# Altium schematic sheet Logturtle_TX_Toplevel.SchDoc
size A4; SheetNumber: 1; SheetTotal: 7
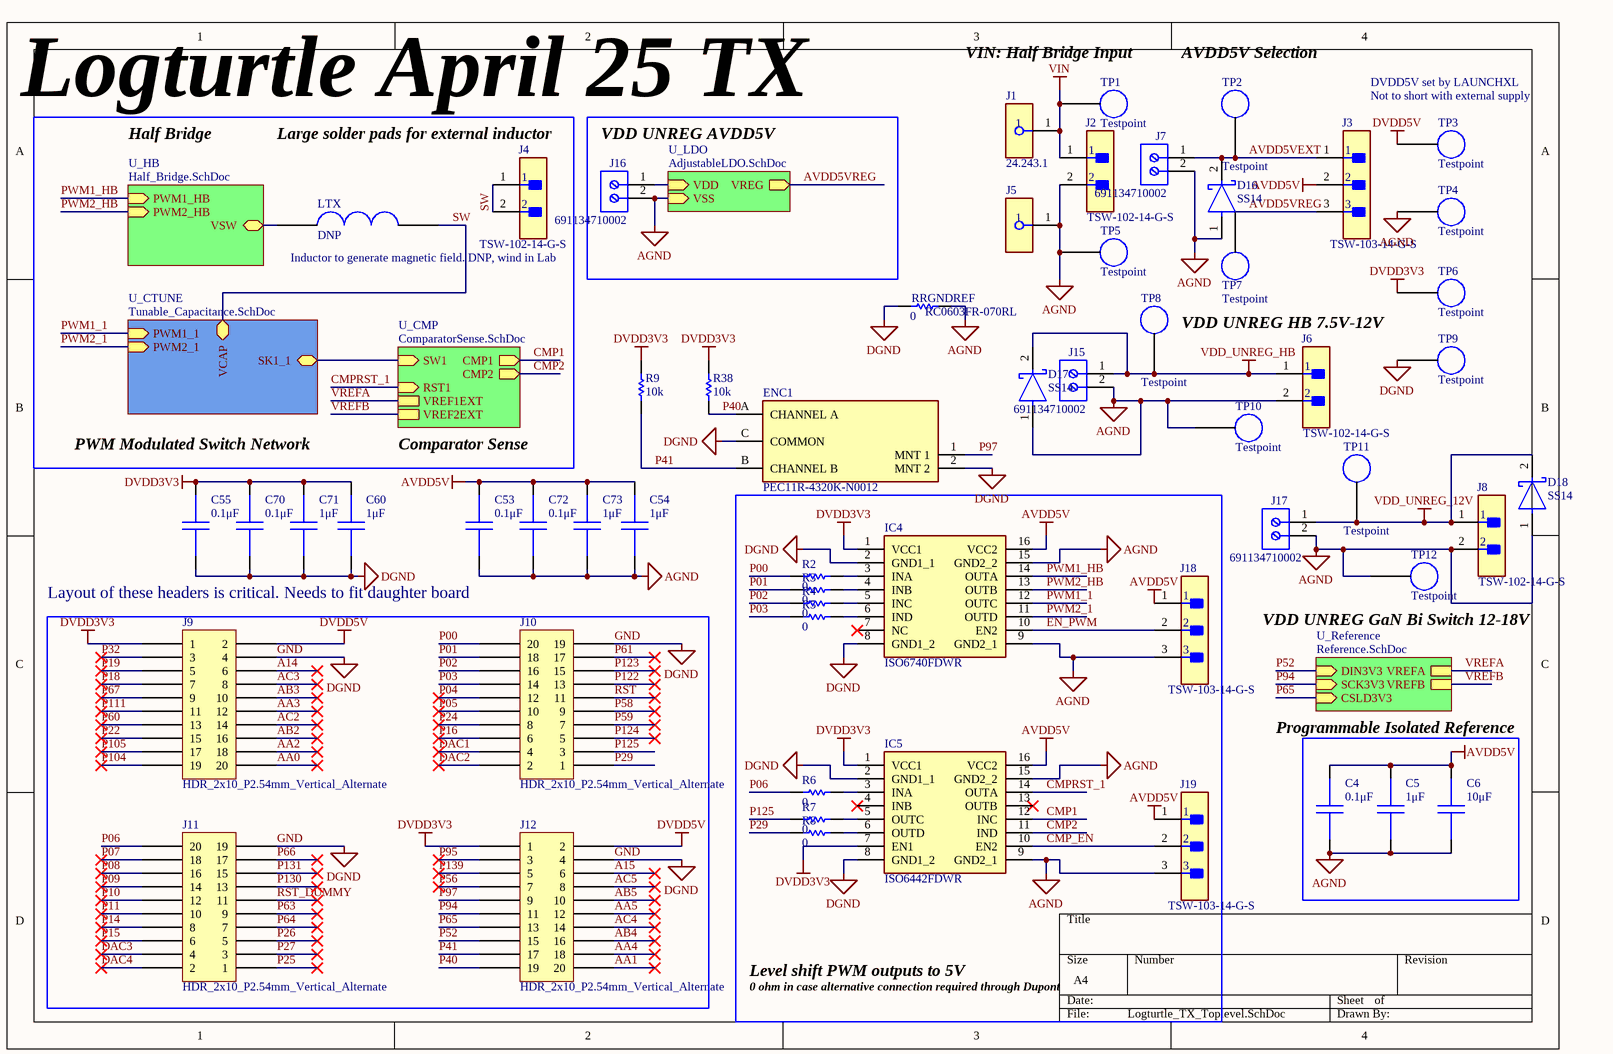
[diagram p0: Logturtle_TX_Toplevel.SchDoc]

## Parts
C4  0.1μF  [CAPC1608X90N]
C5  1μF  [CAPC1608X09N]
C6  10μF  [CAPC2012X14N]
C53  0.1μF  [CAPC1608X90N]
C54  1μF  [CAPC1608X09N]
C55  0.1μF  [CAPC1608X90N]
C60  1μF  [CAPC1608X09N]
C70  0.1μF  [CAPC1608X90N]
C71  1μF  [CAPC1608X09N]
C72  0.1μF  [CAPC1608X90N]
C73  1μF  [CAPC1608X09N]
D16  SS14  [FP-403AE-MFG]
D17  SS14  [FP-403AE-MFG]
D18  SS14  [FP-403AE-MFG]
ENC1  PEC11R-4320K-N0012  [FP-PEC11R-4320K-N0012-MFG]
IC4  ISO6740FDWR  [SOIC127P1030X255-16N]
IC5  ISO6442FDWR  [SOIC127P1030X255-16N]
J1  24.243.1  [FP-24_243_1-MFG]
J2  TSW-102-14-G-S  [FP-TSW-102-14-G-S-MFG]
J3  TSW-103-14-G-S  [FP-TSW-103-14-G-S-MFG]
J4  TSW-102-14-G-S  [FP-TSW-102-14-G-S-MFG]
J5  (no value)  [FP-24_243_2-MFG]
J6  TSW-102-14-G-S  [FP-TSW-102-14-G-S-MFG]
J7  691134710002  [691134710002]
J8  TSW-102-14-G-S  [FP-TSW-102-14-G-S-MFG]
J9  HDR_2x10_P2.54mm_Vertical_Alternate  [HDR_2x10_P2.54mm_Vertical - Alternate]
J10  HDR_2x10_P2.54mm_Vertical_Alternate  [HDR_2x10_P2.54mm_Vertical - Alternate]
J11  HDR_2x10_P2.54mm_Vertical_Alternate  [HDR_2x10_P2.54mm_Vertical - Alternate]
J12  HDR_2x10_P2.54mm_Vertical_Alternate  [HDR_2x10_P2.54mm_Vertical - Alternate]
J15  691134710002  [691134710002]
J16  691134710002  [691134710002]
J17  691134710002  [691134710002]
J18  TSW-103-14-G-S  [FP-TSW-103-14-G-S-MFG]
J19  TSW-103-14-G-S  [FP-TSW-103-14-G-S-MFG]
LTX  DNP  [InductorTerminals]
R2  value 0  [RESC1608X55N]  (hidden comment: RC0603FR-070RL)
R3  value 0  [RESC1608X55N]  (hidden comment: RC0603FR-070RL)
R4  value 0  [RESC1608X55N]  (hidden comment: RC0603FR-070RL)
R5  value 0  [RESC1608X55N]  (hidden comment: RC0603FR-070RL)
R6  value 0  [RESC1608X55N]  (hidden comment: RC0603FR-070RL)
R7  value 0  [RESC1608X55N]  (hidden comment: RC0603FR-070RL)
R8  value 0  [RESC1608X55N]  (hidden comment: RC0603FR-070RL)
R9  value 10k  [RESC1608X55N]  (hidden comment: RC0603FR0710KL)
R38  value 10k  [RESC1608X55N]  (hidden comment: RC0603FR0710KL)
RRGNDREF  RC0603FR-070RL  value 0  [RESC1608X55N]
TP1  Testpoint  [TP_5006]
TP2  Testpoint  [TP_5006]
TP3  Testpoint  [TP_5006]
TP4  Testpoint  [TP_5006]
TP5  Testpoint  [TP_5006]
TP6  Testpoint  [TP_5006]
TP7  Testpoint  [TP_5006]
TP8  Testpoint  [TP_5006]
TP9  Testpoint  [TP_5006]
TP10  Testpoint  [TP_5006]
TP11  Testpoint  [TP_5006]
TP12  Testpoint  [TP_5006]

## Blocks framed on the sheet
VDD UNREG AVDD5V: J16
Level shift PWM outputs to 5V: IC4 IC5 J18 J19 R2-R8

## Sub-sheets
U_CMP = ComparatorSense.SchDoc: SW1 (in), CMP1 (out), CMP2 (out), RST1 (in), VREF1EXT, VREF2EXT
U_CTUNE = Tunable_Capacitance.SchDoc: PWM1_1 (in), PWM2_1 (in), VCAP (bidir), SK1_1 (bidir)
U_HB = Half_Bridge.SchDoc: VSW (bidir), PWM1_HB (in), PWM2_HB (in)
U_LDO = AdjustableLDO.SchDoc: VDD (in), VREG (out), VSS (in)
U_Reference = Reference.SchDoc: VREFA, VREFB, DIN3V3 (in), SCK3V3 (in), CSLD3V3 (in)

## Nets
AGND: C4.1 C5.1 C6.1 C53.1 C54.1 C72.1 C73.1 D16.1(A) D17.1(A) D18.1(A) IC4.9(GND2_1) IC4.15(GND2_2) IC5.9(GND2_1) IC5.15(GND2_2) J2.2 J5.1 J6.2 J7.2 J8.2 J15.2 J16.2 J17.2 J18.3 J19.3 RRGNDREF.1 TP4.1 TP5.1 TP10.1 TP12.1 ; sheet U_LDO/VSS
AVDD5V: C4.2 C5.2 C6.2 C53.2 C54.2 C72.2 C73.2 IC4.16(VCC2) IC5.16(VCC2) J3.2 J18.1 J19.1
DVDD3V3: C55.2 C60.2 C70.2 C71.2 IC4.1(VCC1) IC5.1(VCC1) IC5.7(EN1) J9.1 J12.1 R9.2 R38.2 TP6.1
DVDD5V: J9.2 J12.2 TP3.1
GND: C55.1 C60.1 C70.1 C71.1 ENC1.2(MNT_2) ENC1.C(COMMON) IC4.2(GND1_1) IC4.8(GND1_2) IC5.2(GND1_1) IC5.8(GND1_2) J9.4 J10.19 J11.19 J12.4 RRGNDREF.2 TP9.1  [also labelled DGND]
VDD_UNREG_12V: D18.2(C) J8.1 J17.1 TP11.1
VDD_UNREG_HB: D17.2(C) J6.1 J15.1 TP8.1
VIN: J1.1 J2.1 TP1.1
A14: J9.6
A15: J12.6
AA0: J9.20
AA1: J12.20
AA2: J9.18
AA3: J9.12
AA4: J12.18
AA5: J12.12
AB2: J9.16
AB3: J9.10
AB4: J12.16
AB5: J12.10
AC2: J9.14
AC3: J9.8
AC4: J12.14
AC5: J12.8
AVDD5VEXT: D16.2(C) J3.1 J7.1 TP2.1
AVDD5VREG: J3.3 TP7.1 ; sheet U_LDO/VREG
CMP1: IC5.12(INC) ; sheet U_CMP/CMP1
CMP2: IC5.11(IND) ; sheet U_CMP/CMP2
CMP_EN: IC5.10(EN2) J19.2
CMPRST_1: IC5.14(OUTA) ; sheet U_CMP/RST1
DAC1: J10.4
DAC2: J10.2
DAC3: J11.4
DAC4: J11.2
EN_PWM: IC4.10(EN2) J18.2
P00: J10.20 R2.1
P01: J10.18 R3.1
P02: J10.16 R4.1
P03: J10.14 R5.1
P04: J10.12
P05: J10.10
P06: J11.20 R6.1
P07: J11.18
P08: J11.16
P09: J11.14
P10: J11.12
P11: J11.10
P14: J11.8
P15: J11.6
P16: J10.6
P18: J9.7
P19: J9.5
P22: J9.15
P24: J10.8
P25: J11.1
P26: J11.5
P27: J11.3
P29: J10.1 R8.1
P32: J9.3
P40: ENC1.A(CHANNEL_A) J12.19 R38.1
P41: ENC1.B(CHANNEL_B) J12.17 R9.1
P52: J12.15 ; sheet U_Reference/DIN3V3
P56: J12.7
P58: J10.9
P59: J10.7
P60: J9.13
P61: J10.17
P63: J11.9
P64: J11.7
P65: J12.13 ; sheet U_Reference/CSLD3V3
P66: J11.17
P67: J9.9
P94: J12.11 ; sheet U_Reference/SCK3V3
P95: J12.3
P97: ENC1.1(MNT_1) J12.9
P104: J9.19
P105: J9.17
P111: J9.11
P122: J10.13
P123: J10.15
P124: J10.5
P125: J10.3 R7.1
P130: J11.13
P131: J11.15
P139: J12.5
PWM1_1: IC4.12(OUTC) ; sheet U_CTUNE/PWM1_1
PWM1_HB: IC4.14(OUTA) ; sheet U_HB/PWM1_HB
PWM2_1: IC4.11(OUTD) ; sheet U_CTUNE/PWM2_1
PWM2_HB: IC4.13(OUTB) ; sheet U_HB/PWM2_HB
RST: J10.11
RST_DUMMY: J11.11
SW: J4.1 J4.2 LTX.2 ; sheet U_CTUNE/VCAP
VREFA: sheet U_CMP/VREF1EXT, sheet U_Reference/VREFA
VREFB: sheet U_CMP/VREF2EXT, sheet U_Reference/VREFB
NetIC4_3: IC4.3(INA) R2.2
NetIC4_4: IC4.4(INB) R3.2
NetIC4_5: IC4.5(INC) R4.2
NetIC4_6: IC4.6(IND) R5.2
NetIC5_3: IC5.3(INA) R6.2
NetIC5_5: IC5.5(OUTC) R7.2
NetIC5_6: IC5.6(OUTD) R8.2
NetJ16_1: J16.1 ; sheet U_LDO/VDD
NetLTX_1: LTX.1 ; sheet U_HB/VSW
(unnamed): sheet U_CTUNE/SK1_1, sheet U_CMP/SW1

Not connected (* = marked no-connect by the designer): IC4 7(NC)*; IC5 4(INB)* 13(OUTB)*

## Notes on the sheet
- (near TP1) VIN: Half Bridge Input
- AVDD5V Selection
- Logturtle April 25 TX
- DVDD5V set by LAUNCHXL
- Not to short with external supply
- Half Bridge
- Large solder pads for external inductor
- Inductor to generate magnetic field. DNP, wind in Lab
- VDD UNREG HB 7.5V-12V
- PWM Modulated Switch Network
- Comparator Sense
- Layout of these headers is critical. Needs to fit daughter board
- (near TP12) VDD UNREG GaN Bi Switch 12-18V
- Programmable Isolated Reference
- 0 ohm in case alternative connection required through Dupont

## Library data of the parts
C4 C53 C55 C70 C72 = CC0603KRX7R7BB104: Ceramic Capacitor, Multilayer, Ceramic, 16V, 10% +Tol, 10% -Tol, X7R, 15% TC, 0.1uF, Surface Mount, 0603 https://www.digikey.ie/en/products/detail/yageo/CC0603KRX7R7BB104/302822; Manufacturer: Yageo; Value: 100nF; Multilayer: Yes; Supplier: Digikey; Supplier Part Number: 311-1088-1-ND; Manufacturer Part Number: CC0603KRX7R7BB104; RoHS: Yes; Category: Ceramic Capacitors; Stock: 8597331; Mounting Technology: Surface Mount; Pins: 2; Dielectric Material: Ceramic; Package Shape: Rectangular; Case/Package: 0603; Terminal Finish: Nickel; Min Operating Temperature: -55°C; Max Operating Temperature: 125°C; JESD-609 Code: e3; Capacitor Type: Ceramic; Tolerance  (fill in as +-): 10%; Package Style: SMTMeter; Packaging: Tape and Reel; Tolerance (fill in as +-): 10%; Rated DC Voltage (URdc): 16V; Temperature Characteristics Code: X7R; Termination: Wraparound; Length: 1.6mm; Width: 0.8mm; Height: 0.8mm; Reach SVHC Compliant: Yes; RoHS Compliant: Yes; ComponentLink1URL: https://datasheet.ciiva.com:443/pdfs/VipMasterIC/IC/YAGO/YAGO-S-A0003557223/YAGO-S-A0003557223-1.pdf?src-supplier=IHS+Markit; ComponentLink1Description: https://datasheet.ciiva.com:443/pdfs/VipMasterIC/IC/YAGO/YAGO-S-A0003557223/YAGO-S-A0003557223-1.pdf?src-supplier=IHS+Markit; ComponentLink2URL: https://datasheet.ciiva.com/11786/0900766b80d84f1d-11786077.pdf?src-supplier=Rs; ComponentLink2Description: https://datasheet.ciiva.com/11786/0900766b80d84f1d-11786077.pdf?src-supplier=Rs; ComponentLink3URL: https://datasheet.ciiva.com/8033/70765-8033799.pdf?src-supplier=Element14; ComponentLink3Description: https://datasheet.ciiva.com/8033/70765-8033799.pdf?src-supplier=Element14; ComponentLink4URL: https://datasheet.ciiva.com/7978/1489800-7978141.pdf?src-supplier=Element14; ComponentLink4Description: https://datasheet.ciiva.com/7978/1489800-7978141.pdf?src-supplier=Element14; ComponentLink5URL: https://datasheet.ciiva.com/28450/1489800-28450552.pdf?src-supplier=Element14; ComponentLink5Description: https://datasheet.ciiva.com/28450/1489800-28450552.pdf?src-supplier=Element14; ComponentLink6URL: https://datasheet.ciiva.com/46430/1734573-46430156.pdf?src-supplier=Element14; ComponentLink6Description: https://datasheet.ciiva.com/46430/1734573-46430156.pdf?src-supplier=Element14; ComponentLink7URL: https://datasheet.ciiva.com/144/mlccorderingcode-144183.pdf?src-supplier=Digikey; ComponentLink7Description: https://datasheet.ciiva.com/144/mlccorderingcode-144183.pdf?src-supplier=Digikey; ComponentLink8URL: https://datasheet.ciiva.com/144/mlccorderingcode-144182.pdf?src-supplier=Digikey; ComponentLink8Description: https://datasheet.ciiva.com/144/mlccorderingcode-144182.pdf?src-supplier=Digikey; ComponentLink9URL: https://datasheet.ciiva.com/144/mlccorderingcode-144184.pdf?src-supplier=Digikey; ComponentLink9Description: https://datasheet.ciiva.com/144/mlccorderingcode-144184.pdf?src-supplier=Digikey; ComponentLink10URL: https://datasheet.ciiva.com/8033/1734573-8033797.pdf?src-supplier=Element14; ComponentLink10Description: https://datasheet.ciiva.com/8033/1734573-8033797.pdf?src-supplier=Element14; ComponentLink11URL: https://datasheet.ciiva.com/13395/upy-gphc-x7r-6-3v-to-50v-8-13395674.pdf?src-supplier=Mouser; ComponentLink11Description: https://datasheet.ciiva.com/13395/upy-gphc-x7r-6-3v-to-50v-8-13395674.pdf?src-supplier=Mouser
C5 C54 C60 C71 C73 = CC0603KRX7R7BB105: Ceramic Capacitor, Multilayer, Ceramic, 16V, 10% +Tol, 10% -Tol, X7R, 15% TC, 1uF, Surface Mount, 0603 https://www.digikey.ie/en/products/detail/yageo/CC0603KRX7R7BB105/2833611; Manufacturer: Yageo; Multilayer: Yes; Supplier: Digikey; Supplier Part Number: 311-1446-6-ND; Manufacturer Part Number: CC0603KRX7R7BB105; RoHS: Yes; Category: Ceramic Capacitors; Stock: 9128438; Mounting Technology: Surface Mount; Pins: 2; Dielectric Material: Ceramic; Package Shape: Rectangular; Case/Package: 0603; Terminal Finish: Nickel; Min Operating Temperature: -55°C; Max Operating Temperature: 125°C; JESD-609 Code: e3; Value: 1uF; Capacitor Type: Ceramic; Tolerance  (fill in as +-): 10%; Package Style: SMTMeter; Packaging: Tape and Reel; Tolerance (fill in as +-): 10%; Rated DC Voltage (URdc): 16V; Temperature Characteristics Code: X7R; Termination: Wraparound; Length: 1.6mm; Width: 0.8mm; Height: 0.8mm; Reach SVHC Compliant: Yes; RoHS Compliant: Yes; ComponentLink1URL: https://datasheet.ciiva.com:443/pdfs/VipMasterIC/IC/YAGO/YAGO-S-A0003557223/YAGO-S-A0003557223-1.pdf?src-supplier=IHS+Markit; ComponentLink1Description: https://datasheet.ciiva.com:443/pdfs/VipMasterIC/IC/YAGO/YAGO-S-A0003557223/YAGO-S-A0003557223-1.pdf?src-supplier=IHS+Markit; ComponentLink2URL: https://datasheet.ciiva.com/8033/1734573-8033801.pdf?src-supplier=Element14; ComponentLink2Description: https://datasheet.ciiva.com/8033/1734573-8033801.pdf?src-supplier=Element14; ComponentLink3URL: https://datasheet.ciiva.com/8033/1734573-8033800.pdf?src-supplier=Element14; ComponentLink3Description: https://datasheet.ciiva.com/8033/1734573-8033800.pdf?src-supplier=Element14; ComponentLink4URL: https://datasheet.ciiva.com/7978/1489800-7978143.pdf?src-supplier=Element14; ComponentLink4Description: https://datasheet.ciiva.com/7978/1489800-7978143.pdf?src-supplier=Element14; ComponentLink5URL: https://datasheet.ciiva.com/28450/1489800-28450557.pdf?src-supplier=Element14; ComponentLink5Description: https://datasheet.ciiva.com/28450/1489800-28450557.pdf?src-supplier=Element14; ComponentLink6URL: https://datasheet.ciiva.com/176/mlccorderingcode-176789.pdf?src-supplier=Digikey; ComponentLink6Description: https://datasheet.ciiva.com/176/mlccorderingcode-176789.pdf?src-supplier=Digikey; ComponentLink7URL: https://datasheet.ciiva.com/176/mlccorderingcode-176788.pdf?src-supplier=Digikey; ComponentLink7Description: https://datasheet.ciiva.com/176/mlccorderingcode-176788.pdf?src-supplier=Digikey; ComponentLink8URL: https://datasheet.ciiva.com/176/mlccorderingcode-176790.pdf?src-supplier=Digikey; ComponentLink8Description: https://datasheet.ciiva.com/176/mlccorderingcode-176790.pdf?src-supplier=Digikey; ComponentLink9URL: https://datasheet.ciiva.com/5425/upy-gphc-x7r-6-3v-to-50v-8-12304-5425495.pdf?src-supplier=Mouser; ComponentLink9Description: https://datasheet.ciiva.com/5425/upy-gphc-x7r-6-3v-to-50v-8-12304-5425495.pdf?src-supplier=Mouser
C6 = GRM21BZ71E106KE15L: Multilayer Ceramic Capacitor, 10 uF, 25 V, ï¿½ 10%, X7R, 0805 [2012 Metric] https://www.digikey.ie/en/products/detail/murata-electronics/GRM21BZ71E106KE15L/13904911; Manufacturer: Murata; Material: 4241ConductorMaterial; Value: 10uF; Voltage Rating: 25V; Supplier: Future Electronics; Supplier Part Number: 6134628; Manufacturer Part Number: GRM21BZ71E106KE15L; Category: Ceramic Capacitors; Stock: 81000; Case/Package: 339Case; Min Operating Temperature: -55°C; Max Operating Temperature: 125°C; Tolerance: 10%; Length: 2mm; Width: 1.25mm; Height: 1.45mm; Thickness: 1.25mm; RoHS Compliant: Yes; ComponentLink1URL: https://datasheet.octopart.com/GRM21BZ71E106KE15L-Murata-datasheet-141278873.pdf?src-supplier=Geoflip; ComponentLink1Description: https://datasheet.octopart.com/GRM21BZ71E106KE15L-Murata-datasheet-141278873.pdf?src-supplier=Geoflip; ComponentLink2URL: https://datasheet.octopart.com/GRM21BZ71E106KE15L-Murata-datasheet-165579666.pdf?src-supplier=TME; ComponentLink2Description: https://datasheet.octopart.com/GRM21BZ71E106KE15L-Murata-datasheet-165579666.pdf?src-supplier=TME; ComponentLink3URL: https://datasheet.octopart.com/GRM21BZ71E106KE15L-Murata-datasheet-140707837.pdf?src-supplier=Ciiva+Crawler; ComponentLink3Description: https://datasheet.octopart.com/GRM21BZ71E106KE15L-Murata-datasheet-140707837.pdf?src-supplier=Ciiva+Crawler; ComponentLink4URL: https://datasheet.octopart.com/GRM21BZ71E106KE15L-Murata-datasheet-138745134.pdf?src-supplier=Ciiva+Crawler; ComponentLink4Description: https://datasheet.octopart.com/GRM21BZ71E106KE15L-Murata-datasheet-138745134.pdf?src-supplier=Ciiva+Crawler
D16-D18 = CMP-2000-04943-2: DIODE SCHOTTKY 40V 1A SMA; Manufacturer: ON Semiconductor; Peak Reverse Current: 0.2mA; Max Junction Temp: +125°C; Standoff Height: 0.05mm; Max Surge Forward Current: 40A; Mouser Description: Schottky Diodes & Rectifiers SMA 40V 1.0A; RoHS: TRUE; Lead Free: Yes; Manufacturer Part Number: SS14; Device Class L3: Schottky Diodes; Category: Diode; Automotive: No; Digikey Description: DIODE SCHOTTKY 40V 1A SMA; ComponentLink2Description: Datasheet; Device Class L2: Diodes; Height: 2.5mm; Temperature Range High: +125°C; ComponentLink2URL: https://www.onsemi.com/pub/Collateral/SS19-D.PDF; Device Class L1: Discrete Semiconductors; Package: 403AE; Octopart: https://octopart.com/ss14-on+semiconductor-29205033; Max Repetitive Reverse Voltage: 40V; Temperature Range Low: -65°C; Forward Current: 1A; Temperature: -65°C to +125°C
ENC1 = CMP-07421-000024-1: ROTARY ENCODER MECHANICAL 12PPR; Detent: Yes; Built in Switch: No; Number of Channels: 2; Pulses per Revolution: 12; Output Type: Quadrature; Width: 12.5mm; Packaging: Bulk; Mount: Through Hole; Min Operating Temperature: -30°C; Termination: PC Pin; Package Quantity: 75; Orientation: Vertical; Encoder Type: Mechanical; RoHS Compliant: Yes; Height: 13.4mm; Length: 26.5mm; Max Operating Temperature: 70°C
IC4 = ISO6440FDWR: Texas Instruments ISO6740FDWR; Manufacturer_Part_Number: ISO6441FDWR; Datasheet Link: https://www.ti.com/lit/ds/symlink/iso6441.pdf?ts=1759392249492&ref_url=https%253A%252F%252Fwww.ti.com%252Fproduct%252FISO6441; Height: 2.55mm; Manufacturer_Name: Texas Instruments
IC5 = ISO6442FDWR: Texas Instruments ISO6742FDWR; Manufacturer_Part_Number: ISO6441FDWR; Datasheet Link: https://www.ti.com/lit/ds/symlink/iso6441.pdf?ts=1759392249492&ref_url=https%253A%252F%252Fwww.ti.com%252Fproduct%252FISO6441; Height: 2.55mm; Manufacturer_Name: Texas Instruments
J1 = CMP-12400-000001-2: Banana Test Connector, 4mm, Socket, PCB Mount, 24 A, 60 VDC, Silver Plated Contacts, Green; Gender: Male; Voltage Rating: 30V; Current Rating: 20A; REACH SVHC: No SVHC; Contact Material: Brass; RoHS Compliant: Yes; Contact Plating: Silver; Voltage Rating (DC): 30V; Length: 24mm; Termination: Solder
J2 J4 J6 J8 = CMP-02766-001740-1: CONN HEADER VERT 2POS 2.54MM; Number of Positions: 2; Max Current Rating: 7.6A; Gender: Male; Max Voltage Rating (AC): 550V; Contact Mating Length: 0.32inch; REACH SVHC: No SVHC; Width: 2.54mm; Insulation Material: PBT; Contact Shape: Square; Contact Plating: Gold; Min Operating Temperature: -55°C; Contact Material: Bronze; Color: Black; Number of Contacts: 2; Housing Material: Polyester; Orientation: Straight; Flammability Rating: UL94 V-0; Max Operating Temperature: 125°C; Contact Type: Male Pin; Radiation Hardening: No; Termination: Solder; RoHS Compliant: Yes; Lead Free: Lead Free; Fastening Type: Pull; Pitch: 2.54mm; Number of Rows: 1; Series: TSW; Insulation Color: Black; Package Quantity: 1; Connector Type: Header; Length: 5.08mm; Contact Finish - Mating: GOLD; Mount: Through Hole; Housing Color: Black; Depth: 2.54mm; Packaging: Bulk
J3 J18 J19 = CMP-02766-001743-1: CONN HEADER VERT 3POS 2.54MM; Max Voltage Rating (AC): 550V; Number of Positions: 3; Max Current Rating: 7.6A; Gender: Male; Termination: Solder; RoHS Compliant: Yes; Mount: Through Hole; Lead Free: Lead Free; Connector Type: Header; REACH SVHC: No SVHC; Insulation Color: Black; Width: 2.54mm; Length: 7.62mm; Flammability Rating: UL94 V-0; Housing Material: Polyester; Contact Material: Bronze; Max Operating Temperature: 125°C; Fastening Type: Pull; Series: TSW; Number of Contacts: 3; Packaging: Bulk; Min Operating Temperature: -55°C; Package Quantity: 1; Height: 10.67mm; Pitch: 2.54mm; Contact Finish - Mating: GOLD; Contact Type: Male Pin; Radiation Hardening: No; Color: Black; Housing Color: Black; Contact Plating: Gold; Orientation: Straight; Number of Rows: 1; Depth: 2.54mm; Insulation Material: PBT; Contact Mating Length: 0.32inch; Contact Shape: Square
J5 = CMP-12400-000002-2: RECEPTACLE, 20A, 4MM, PCB, SOLDER, BLACK; Gender: Male; Current Rating: 20A; Contact Plating: Silver; Termination: Solder; Length: 24mm; REACH SVHC: No SVHC; Contact Material: Brass
J7 J15-J17 = CMP-1502-03295-3: Wire-To-Board Terminal Block, 5mm Pitch, Horizontal, Screw, 2 Poles
LTX = InductorTX
R2-R8 RRGNDREF = RC0603FR-070RL: Resistor, 0 Ohms Jumper 0.1W, 1/10W Chip Resistor 0603 (1608 Metric) Moisture Resistant Thick Film; Manufacturer_Name: YAGEO; Datasheet Link: http://www.yageo.com/documents/recent/PYu-RC0603_51_RoHS_L_v5.pdf; Height: 0.55mm; Manufacturer_Part_Number: RC0603FR-070RL; Mouser Part Number: 603-RC0603FR-070RL; Mouser Price/Stock: https://www.mouser.co.uk/ProductDetail/YAGEO/RC0603FR-070RL?qs=0yPvnVz5%2FmpDQv43TwvCfw%3D%3D; Arrow Part Number: RC0603FR-070RL; Arrow Price/Stock: https://www.arrow.com/en/products/rc0603fr-070rl/yageo?region=nac
R9 R38 = RC0603FR0710KL: Resistor, 10 kOhms ±1% 0.1W, 1/10W Chip Resistor 0603 (1608 Metric) Moisture Resistant Thick Film; Manufacturer_Name: YAGEO; Datasheet Link: http://www.yageo.com/documents/recent/PYu-RC0603_51_RoHS_L_v5.pdf; Height: 0.55mm; Manufacturer_Part_Number: RC0603FR0710KL; Arrow Part Number: RC0603FR0710KL; Arrow Price/Stock: https://www.arrow.com/en/products/rc0603fr-0710kl/yageo